# EAGLE design Qwiic_FM_Transceiver_Si4721 (EAGLE 9.5.1)
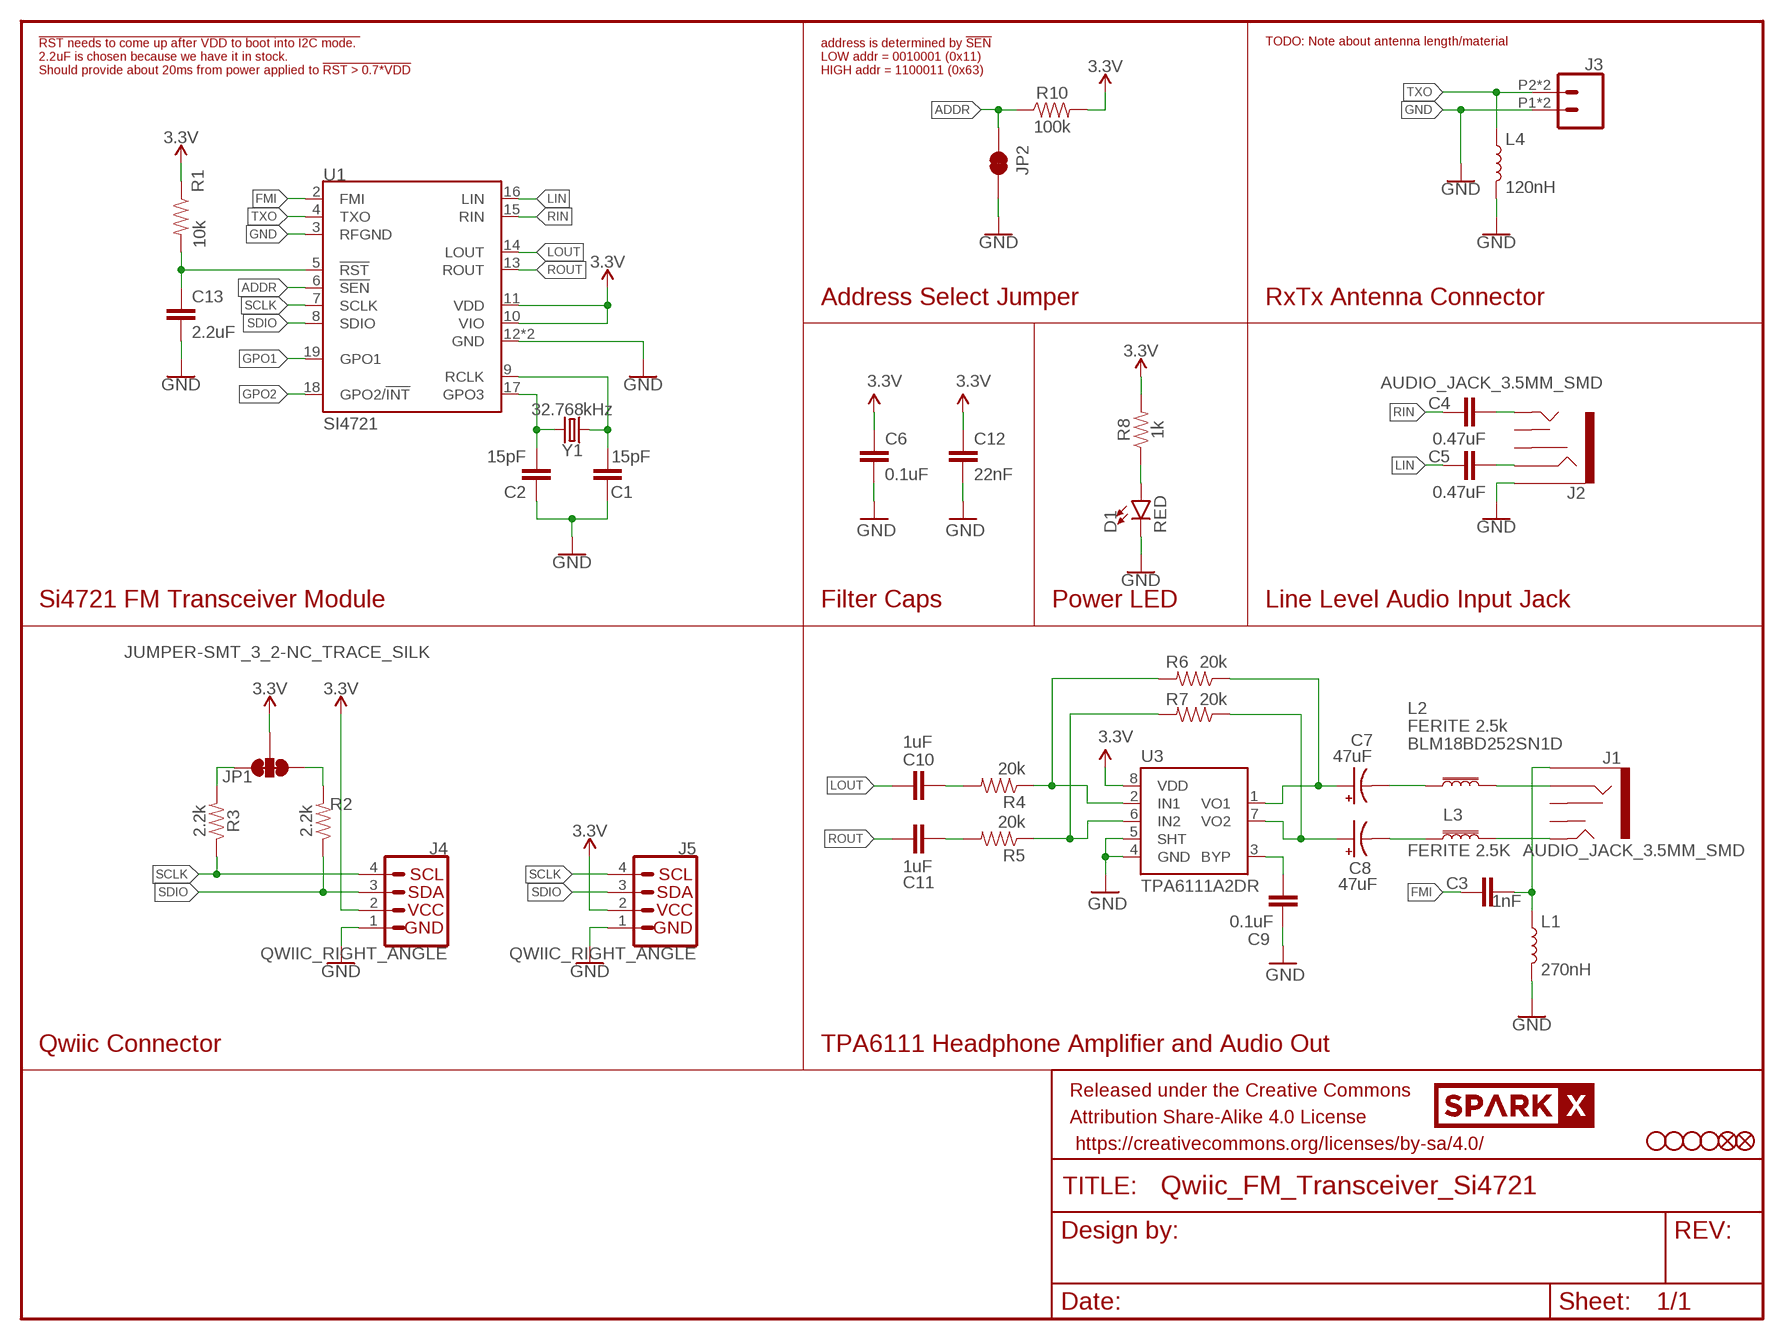
[diagram p0: schematic, sheet 1]

## Parts
C1  15pF  15PF-0603-50V-5%  [0603]
C2  15pF  15PF-0603-50V-5%  [0603]
C3  1nF  1.0NF/1000PF-0603-50V-10%  [0603]
C4  0.47uF  CAP-0603  [0603]
C5  0.47uF  CAP-0603  [0603]
C6  0.1uF  0.1UF-0603-25V-(+80/-20%)  [0603]
C7  47uF  47UF-POLAR-EIA3528-10V-10%  [EIA3528]
C8  47uF  47UF-POLAR-EIA3528-10V-10%  [EIA3528]
C9  0.1uF  0.1UF-0603-25V-(+80/-20%)  [0603]
C10  1uF  1.0UF-16V-10%(0603)  [0603-CAP]
C11  1uF  1.0UF-16V-10%(0603)  [0603-CAP]
C12  22nF  22NF/22,000PF-0603-50V-10%  [0603]
C13  2.2uF  2.2UF-0603-10V-20%  [0603]
D1  RED  LED-RED0603  [LED-0603]
FD1  FIDUCIAL0.2MM  [FIDUCIAL-0.2MM]
FD2  FIDUCIAL0.2MM  [FIDUCIAL-0.2MM]
FRAME1  FRAME-LETTER  [CREATIVE_COMMONS]
H1  STAND-OFF  [STAND-OFF]
H2  STAND-OFF  [STAND-OFF]
H3  STAND-OFF  [STAND-OFF]
H4  STAND-OFF  [STAND-OFF]
J1  AUDIO_JACK_3.5MM_SMD  [AUDIO-JACK-3.5MM-SMD]
J2  AUDIO_JACK_3.5MM_SMD  [AUDIO-JACK-3.5MM-SMD]
J3  CONN_02SMALL_POKEHOME  [1X02_POKEHOME]
J4  QWIIC_RIGHT_ANGLE  QWIIC_CONNECTORJS-1MM  [JST04_1MM_RA]
J5  QWIIC_RIGHT_ANGLE  QWIIC_CONNECTORJS-1MM  [JST04_1MM_RA]
JP1  JUMPER-SMT_3_2-NC_TRACE_SILK  [SMT-JUMPER_3_2-NC_TRACE_SILK]
JP2  JUMPER-SMT_2_NC_TRACE_SILK  [SMT-JUMPER_2_NC_TRACE_SILK]
L1  270nH  INDUCTOR-0603-15NH  [0603]
L2  FERITE 2.5k  FERRITE_BEAD-0603  [0603]
L3  FERITE 2.5K  FERRITE_BEAD-0603  [0603]
L4  120nH  INDUCTOR-0603-15NH  [0603]
R1  10k  10KOHM-0603-1/10W-1%  [0603]
R2  2.2k  2.2KOHM-0603-1/10W-1%  [0603]
R3  2.2k  2.2KOHM-0603-1/10W-1%  [0603]
R4  20k  20KOHM-0603-1/10W-5%  [0603]
R5  20k  20KOHM-0603-1/10W-5%  [0603]
R6  20k  20KOHM-0603-1/10W-5%  [0603]
R7  20k  20KOHM-0603-1/10W-5%  [0603]
R8  1k  1KOHM-0603-1/10W-1%  [0603]
R10  100k  100KOHM-0603-1/10W-1%  [0603]
U1  SI4721  [QFN-20-3X3MM]
U3  TPA6111A2DR  TPA6111SMD-T  [SO08]
U$18  SPARKX-LOGO4  [SPARKX-MEDIUM]
Y1  32.768kHz  CRYSTAL-32.768KHZSMD-3.2X1.5  [CRYSTAL-SMD-3.2X1.5MM]

## Nets
3.3V: C6.1 C12.1 J4.2 J5.2 JP1.2 R1.1 R8.2 R10.2 U1.10(VIO) U1.11(VDD) U3.8(VDD)
ADDR: JP2.1 R10.1 U1.6(!SEN)
FMI: C3.1 U1.2(FMI)
GND: C1.1 C2.1 C6.2 C9.2 C12.2 C13.2 D1.C J2.SLEEVE J3.P1 J3.P3 J4.1 J5.1 JP2.2 L1.2 L4.2 U1.3(RFGND) U1.12(GND) U1.21(GND) U3.4(GND) U3.5(SHT)
GPO1: U1.19(GPO1)
GPO2: U1.18(GPO2/!INT)
LIN: C5.1 U1.16(LIN)
LOUT: C10.1 U1.14(LOUT)
N$1: C13.1 R1.2 U1.5(!RST)
N$2: C1.2 U1.9(RCLK) Y1.P$1
N$3: J1.RING L2.2
N$4: J1.TIP L3.2
N$5: C3.2 J1.SLEEVE L1.1
N$6: C4.2 J2.TIP
N$7: C7.A(+) R6.1 U3.1(VO1)
N$8: C2.2 U1.17(GPO3) Y1.P$2
N$9: C8.A(+) R7.1 U3.7(VO2)
N$10: C9.1 U3.3(BYP)
N$11: R4.1 R6.2 U3.2(IN1)
N$12: R5.1 R7.2 U3.6(IN2)
N$13: C10.2 R4.2
N$14: C11.2 R5.2
N$15: C7.C(-) L2.1
N$16: C8.C(-) L3.1
N$17: C5.2 J2.RING
N$18: JP1.3 R2.2
N$19: JP1.1 R3.2
N$20: D1.A R8.1
RIN: C4.1 U1.15(RIN)
ROUT: C11.1 U1.13(ROUT)
SCLK: J4.4 J5.4 R3.1 U1.7(SCLK)
SDIO: J4.3 J5.3 R2.1 U1.8(SDIO)
TXO: J3.P2 J3.P4 L4.1 U1.4(TXO)
Unconnected: J1.RSH J1.TSH J2.RSH J2.TSH

## Notes on the sheet
- TODO: Note about antenna length/material
- !RST needs to come up after VDD to boot into I2C mode. 
  2.2uF is chosen because we have it in stock. 
  Should provide about 20ms from power applied to !RST > 0.7*VDD
- address is determined by !SEN
  LOW addr = 0010001 (0x11)
  HIGH addr = 1100011 (0x63)
- Address Select Jumper | RxTx Antenna Connector
- Si4721 FM Transceiver Module | Filter Caps | Power LED | Line Level Audio Input Jack
- BLM18BD252SN1D
- Qwiic Connector | TPA6111 Headphone Amplifier and Audio Out

## Library data of the parts
C1 C2 = SparkFun-Capacitors:15PF: 15pF ceramic capacitors A capacitor is a passive two-terminal electrical component used to store electrical energy temporarily in an electric field.; PROD_ID: CAP-07881
C3 = SparkFun-Capacitors:1.0NF/1000PF: 1nF/1,000pF ceramic capacitors A capacitor is a passive two-terminal electrical component used to store electrical energy temporarily in an electric field.; PROD_ID: CAP-07886
C4 C5 = SparkFun-Capacitors:CAP
C6 C9 = SparkFun-Capacitors:0.1UF: 0.1µF ceramic capacitors A capacitor is a passive two-terminal electrical component used to store electrical energy temporarily in an electric field.; PROD_ID: CAP-00810
C7 C8 = SparkFun-Capacitors:47UF-POLAR: 47µF polarized capacitors A capacitor is a passive two-terminal electrical component used to store electrical energy temporarily in an electric field.; PROD_ID: CAP-08310
C10 C11 = SparkFun-Capacitors:1.0UF-16V-10%(0603): CAP-00868; PROD_ID: CAP-00868; VALUE: 1.0uF
C12 = SparkFun-Capacitors:22NF/22,000PF: 0.022uF/22nF/22,000pF ceramic capacitors A capacitor is a passive two-terminal electrical component used to store electrical energy temporarily in an electric field.; PROD_ID: CAP-07885
C13 = SparkFun-Capacitors:2.2UF: 2.2µF ceramic capacitors A capacitor is a passive two-terminal electrical component used to store electrical energy temporarily in an electric field.; PROD_ID: CAP-07888
D1 = SparkFun-LED:LED-RED: Red SMD LED Used in manufacturing of most products at SparkFun Packages: 0603 - SMD 0603 package [Product Link] <http://docs.avagotech.com/docs/AV02-0551EN> 0603 SMART - SMD 0603 SMART package ( more efficient and expensive)[Product Link] <http://www.osram-os.com/Graphics/XPic2/00077099_0.pdf> 1206 - SMD1206 package [Product Link] <https://www.sparkfun.com/datasheets/DevTools/LilyPad/Q150OVS4.pdff> SparkFun Products: Pro Mini 328 -5V <https://www.sparkfun.com/products/821> RedBoard <https://www.sparkfun.com/products/12757> IOIO-OTG <https://www.sparkfun.com/products/13613>; PROD_ID: DIO-00819
FD1 FD2 = SparkFun-Aesthetics:FIDUCIAL: Fiducial Alignment Points Point-of-reference for pick-and-place machines and other optical instruments.
FRAME1 = SparkFun-Aesthetics:FRAME-LETTER: Schematic Frame - Letter Standard 8.5x11 US Letter frame
H1-H4 = SparkFun-Hardware:STAND-OFF: Stand Off Drill holes for mechanically mounting via screws, standoffs, etc. Note: Use the keepout ring to avoid running the screw head into surrounding components. Variant Overviews STAND-OFF - Mechanical footprint for a #4 phillips button head screw. STAND-OFF-TIGHT - Mechanical footprint for a #4 phillips button head screw, Example SparkFun Products Screw - Phillips Head (1/4", 4-40, 10 pack) <https://www.sparkfun.com/products/10453> (PRT-10453) Screw - Phillips Head (1/2", 4-40, 10 pack) <https://www.sparkfun.com/products/10452> (PRT-10452) Screw - Phillips Head (3/4", 4-40, 10 pack) <https://www.sparkfun.com/products/10451> (PRT-10451) Screw - Phillips Head (1", 4-40, 10 pack) <https://www.sparkfun.com/products/10450> (PRT-10450)
J1 J2 = SparkFun-Connectors:AUDIO_JACK_3.5MM: Audio Jack 3.5mm variants of PTH and SMT stereo audio jack with bypass switches. SparkFun Products: SparkFun SparkPunk Sound Kit <[https://www.sparkfun.com/products/11177]> - PTH MP3 Trigger <https://www.sparkfun.com/products/13720> -3.5mm SMD SparkFun PicoBoard <https://www.sparkfun.com/products/11888>- 2.5mm SMD; PROD_ID: CONN-10353
J3 = SparkFun-Connectors:CONN_02: Multi connection point. Often used as Generic Header-pin footprint for 0.1 inch spaced/style header connections On any of the 0.1 inch spaced packages, you can populate with these: Break Away Headers - Straight <https://www.sparkfun.com/products/116> (PRT-00116) Break Away Male Headers - Right Angle <https://www.sparkfun.com/products/553> (PRT-00553) Female Headers <https://www.sparkfun.com/products/115> (PRT-00115) Break Away Headers - Machine Pin <https://www.sparkfun.com/products/117> (PRT-00117) Break Away Female Headers - Swiss Machine Pin <https://www.sparkfun.com/products/743> (PRT-00743) For SCREWTERMINALS and SPRING TERMINALS visit here: Screw Terimnals on SparkFun.com <https://www.sparkfun.com/search/results?term=Screw+Terminals> (5mm/3.5mm/2.54mm spacing) This device is also useful as a general connection point to wire up your design to another part of your project. Our various solder wires solder well into these plated through hole pads. Hook-Up Wire - Assortment (Stranded, 22 AWG) <https://www.sparkfun.com/products/11375> (PRT-11375) Hook-Up Wire - Assortment (Solid Core, 22 AWG) <https://www.sparkfun.com/products/11367> (PRT-11367) View the entire wire category on our website here <https://www.sparkfun.com/categories/141> Special notes: Molex polarized connector foot print use with: PRT-08233 with associated crimp pins and housings. 2.54_SCREWTERM for use with PRT-10571. 3.5mm Screw Terminal footprints for PRT-08084 5mm Screw Terminal footprints for use with PRT-08432; PROD_ID: CONN-13512
J4 J5 = SparkFun-Connectors:QWIIC_CONNECTOR: SparkFun I2C Standard Qwiic Connector An SMD 1mm pitch JST connector makes it easy and quick (get it? Qwiic?) to connect I2C devices to each other. The Qwiic system <http://www.sparkfun.com/qwiic> enables fast and solderless connection between popular platforms and various sensors and actuators. We carry 200mm <https://www.sparkfun.com/products/14204>, 100mm <https://www.sparkfun.com/products/14205>, 50mm <https://www.sparkfun.com/products/14206>, and breadboard friendly <https://www.sparkfun.com/products/14207> Qwiic cables. We also offer 10 pcs strips <https://www.sparkfun.com/products/14323> the SMD connectors.; PROD_ID: CONN-13694
JP1 = SparkFun-Jumpers:JUMPER-SMT_3_2-NC_TRACE: Normally closed trace jumper (2 of 2 connections) This jumper has a trace between all three pads so they are normally closed (NC). Use a razor knife to open the connection(s). For best results follow the IPC guidelines for cutting traces: Cutout at least 0.063 mm (0.005 in). Remove all loose material to clean up the cut area. Seal the cut with an approved epoxy. Reapply solder to reclose the connection(s).
JP2 = SparkFun-Jumpers:JUMPER-SMT_2_NC_TRACE: Normally closed trace jumper This jumper has a trace between two pads so it's normally closed (NC). Use a razor knife to open the connection. For best results follow the IPC guidelines for cutting traces: Cutout at least 0.063 mm (0.005 in). Remove all loose material to clean up the cut area. Seal the cut with an approved epoxy. Reapply solder to reclose the connection.
L1 L4 = SparkFun-Coils:INDUCTOR: Inductors Resist changes in electrical current. Basically a coil of wire. SparkFun Products: SparkFun Load Cell Amplifier - HX711 <https://www.sparkfun.com/products/13879> IOIO-OTG - V2.2 <https://www.sparkfun.com/products/13613>; PROD_ID: NDUC-11660; VALUE: 15nH
L2 L3 = SparkFun-Coils:FERRITE_BEAD: Ferrite Bead (blocks, cores, rings, chokes, etc.) Inductor with layers of ferrite used to suppress high frequencies. Often used to isolate high frequency noise. SparkFun Products: IOIO-OTG - V2.2 <https://www.sparkfun.com/products/13613> SparkFun SAMD21 Mini Breakout <https://www.sparkfun.com/products/13664> SparkFun 6 Degrees of Freedom Breakout - LSM6DS3 <https://www.sparkfun.com/products/13339> SparkFun SAMD21 Dev Breakout <https://www.sparkfun.com/products/13672>; PROD_ID: NDUC-13805; VALUE: 30Ω/1.8A
R1 = SparkFun-Resistors:10KOHM: 10kΩ resistor A resistor is a passive two-terminal electrical component that implements electrical resistance as a circuit element. Resistors act to reduce current flow, and, at the same time, act to lower voltage levels within circuits. - Wikipedia; PROD_ID: RES-00824
R2 R3 = SparkFun-Resistors:2.2KOHM: 2.2kΩ resistor A resistor is a passive two-terminal electrical component that implements electrical resistance as a circuit element. Resistors act to reduce current flow, and, at the same time, act to lower voltage levels within circuits. - Wikipedia; PROD_ID: RES-08272
R4-R7 = SparkFun-Resistors:20KOHM: 20kΩ resistor A resistor is a passive two-terminal electrical component that implements electrical resistance as a circuit element. Resistors act to reduce current flow, and, at the same time, act to lower voltage levels within circuits. - Wikipedia; PROD_ID: RES-09231
R8 = SparkFun-Resistors:1KOHM: 1kΩ resistor A resistor is a passive two-terminal electrical component that implements electrical resistance as a circuit element. Resistors act to reduce current flow, and, at the same time, act to lower voltage levels within circuits. - Wikipedia; PROD_ID: RES-07856
R10 = SparkFun-Resistors:100KOHM: 100kΩ resistor A resistor is a passive two-terminal electrical component that implements electrical resistance as a circuit element. Resistors act to reduce current flow, and, at the same time, act to lower voltage levels within circuits. - Wikipedia; PROD_ID: RES-07828
U1 = SparkFun-RF:SI4721
U3 = SparkFun-IC-Amplifiers:TPA6111: TPA6111A2 Basic 150mW stereo headphone amplifier. SparkFun Products SparkFun FM Tuner Evaluation Board - Si4703 <https://www.sparkfun.com/products/12938> (WRL-12938); PROD_ID: IC-10149
U$18 = SparkX:SPARKX-LOGO
Y1 = SparkFun-Clocks:CRYSTAL-32.768KHZ: 32.768kHz Crystal Frequency: 32.768kHz Frequency Stability: ±20ppm Load Capacitance: 12.5pF (PTH-2X6 & SMD-3.2X1.5), 6pF (SMD-2X6) SparkFun Products: SparkFun BigTime Watch Kit <https://www.sparkfun.com/products/11734> SparkFun nRF52832 Breakout <https://www.sparkfun.com/products/13990> SparkFun Real Time Clock Module <https://www.sparkfun.com/products/12708>; PROD_ID: XTAL-13062

## Board
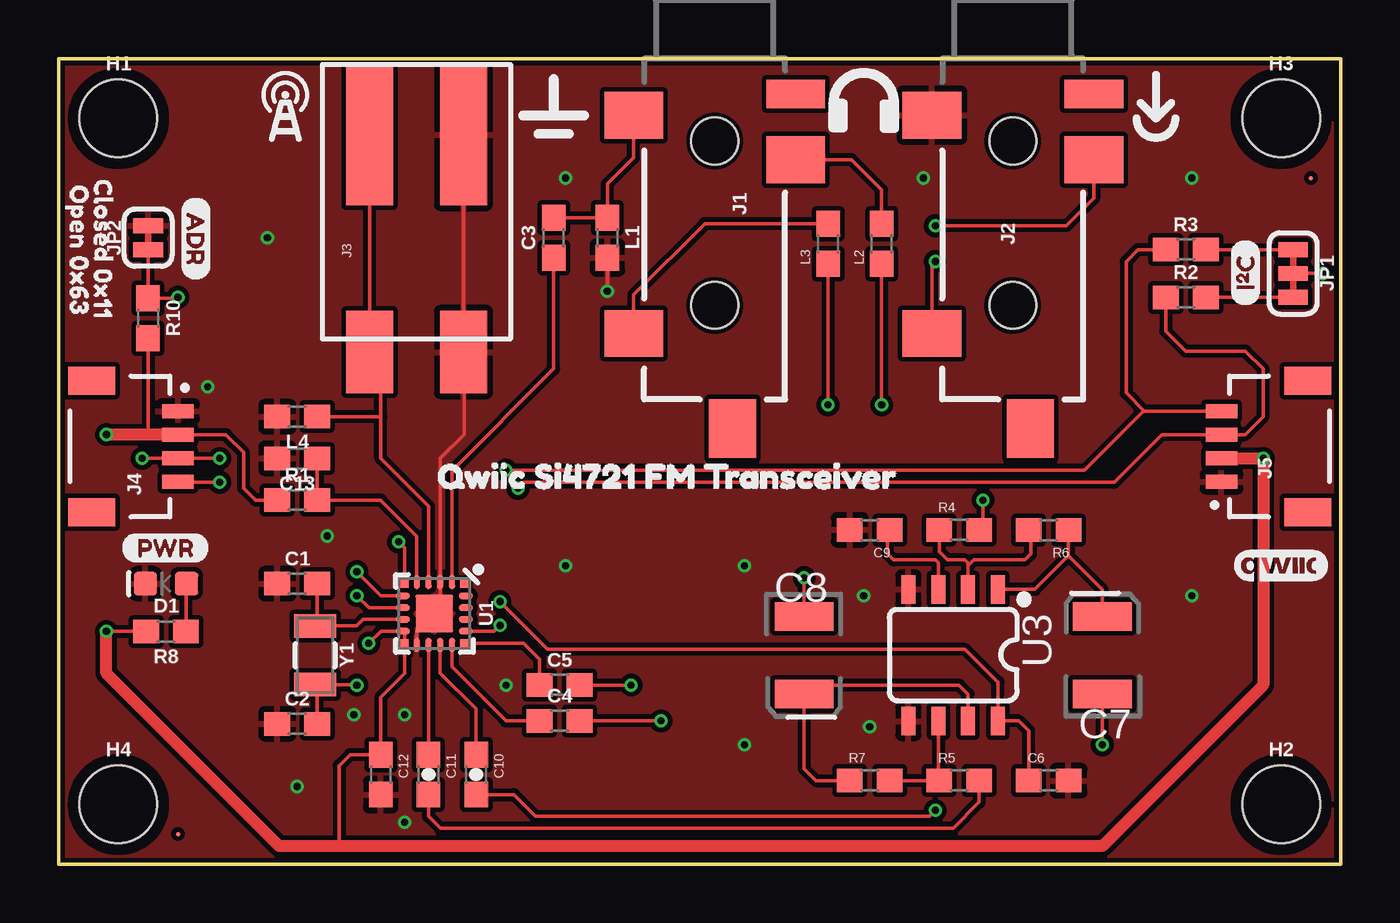
[diagram p1: board, top side]
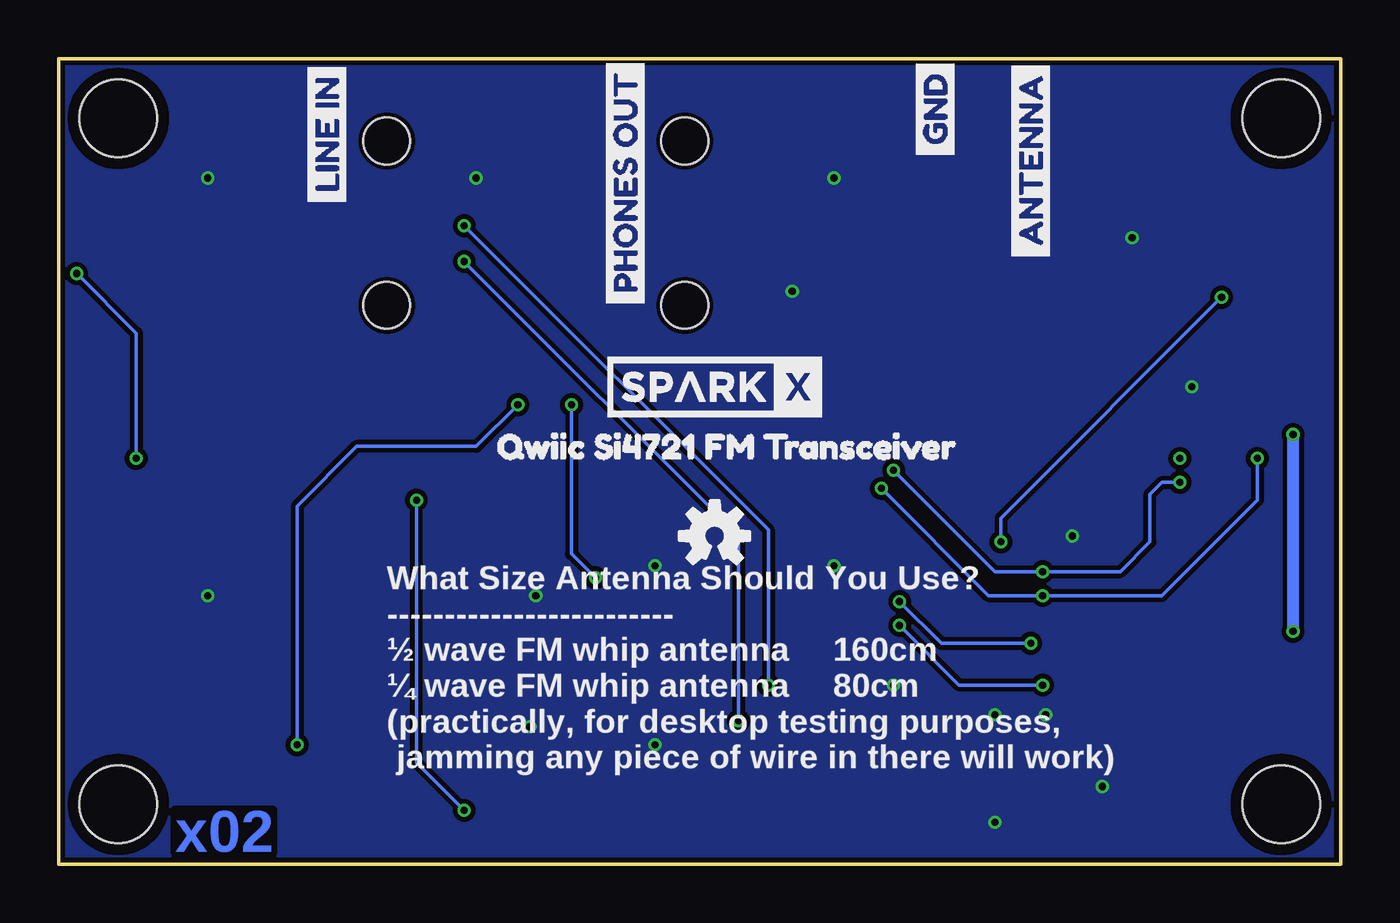
[diagram p2: board, bottom side, seen from below]

Size 54.61 x 34.29 mm. Coordinates in mm from the lower left corner, seen from the top.
Outline: 0,0 0,34.29 54.61,34.29 54.61,0 0,0
Copper layers (1*16): Top 0.035mm / dielectric 1.5mm / Bottom 0.035mm
Design rules "SparkFun-2-layer-FAB-LIMIT": minimum track width 4mil, minimum drill 6mil, track to track 4mil, track to pad 4mil, pad to pad 4mil, via to via 4mil, smd to smd 4mil, copper to edge 4mil, drill to drill 4mil, minimum pad ring 5mil, minimum via ring 5mil, stop-mask expansion 4mil, vias tented up to drill 25mil, thermal gap 10mil

### Footprints (pad centres in the part's own frame; a part is rotated, then mirrored left to right if it is on the bottom)
0603 = smd 1.1 x 1: 1 -0.85,0; 2 0.85,0
EIA3528 = smd 1.2 x 2.5: A 1.65,0; C -1.65,0
0603-CAP = smd 1.1 x 1: 1 -0.85,0; 2 0.85,0
LED-0603 = smd 1 x 1: A -0.877,0; C 0.877,0
FIDUCIAL-0.2MM = smd 0.2 x 0.2: 1 0,0
STAND-OFF = hole 3.302: 0,0
AUDIO-JACK-3.5MM-SMD = smd 2 x 2.5: RING 4.3,3.45; SLEEVE 2.4,-3.45; TIP 11.7,-3.45 | smd 1.2 x 2.5: RSH 1.5,3.45 | smd 2.5 x 2: TSH 15.75,0.75 | hole 2: 3.5,0; 10.5,0
1X02_POKEHOME = smd 3.5 x 2: P1 5.25,2; P2 5.25,-2 | smd 6 x 2: P3 -4,2; P4 -4,-2
JST04_1MM_RA = smd 0.6 x 1.35: 1 -1.5,0; 2 -0.5,0; 3 0.5,0; 4 1.5,0 | smd 1.2 x 2: NC1 2.8,-3.675; NC2 -2.8,-3.675
SMT-JUMPER_3_2-NC_TRACE_SILK = smd 0.635 x 1.27: 1 -1.016,0; 2 0,0; 3 1.016,0
SMT-JUMPER_2_NC_TRACE_SILK = smd 0.635 x 1.27: 1 -0.508,0; 2 0.508,0
QFN-20-3X3MM = smd 0.34 x 0.34: 1 -1.275,1.265; 6 -1.265,-1.265; 11 1.265,-1.265; 16 1.265,1.265 | smd 0.61 x 0.28: 2 -1.335,0.75; 3 -1.335,0.25; 4 -1.335,-0.25; 5 -1.335,-0.75; 12 1.335,-0.75; 13 1.335,-0.25; 14 1.335,0.25; 15 1.335,0.75 | smd 0.28 x 0.61: 7 -0.75,-1.335; 8 -0.25,-1.335; 9 0.25,-1.335; 10 0.75,-1.335; 17 0.75,1.335; 18 0.25,1.335; 19 -0.25,1.335; 20 -0.75,1.335 | smd 1.6 x 1.6: 21 0,0
SO08 = smd 0.6 x 1.2: 1 -1.905,-2.8; 2 -0.635,-2.8; 3 0.635,-2.8; 4 1.905,-2.8; 5 1.905,2.8; 6 0.635,2.8; 7 -0.635,2.8; 8 -1.905,2.8
CRYSTAL-SMD-3.2X1.5MM = smd 1 x 1.8: P$1 -1.25,0; P$2 1.25,0

### Placement (x,y rotation side)
C1  10.16,11.94 0 top
C2  10.16,5.97 0 top
C3  21.08,26.67 90 top
C4  21.34,6.1 0 top
C5  21.34,7.62 0 top
C6  42.16,3.56 0 top
C7  44.45,8.89 90 top
C8  31.75,8.89 270 top
C9  34.54,14.22 180 top
C10  17.78,3.81 270 top
C11  15.75,3.81 270 top
C12  13.72,3.81 270 top
C13  10.16,17.27 180 top
D1  4.57,11.94 180 top
FD1  53.34,29.21 0 top
FD2  5.08,1.27 0 top
FRAME1  5.08,-13.97 0 top  (outside the outline)
H1  2.54,31.75 0 top
H2  52.07,2.54 0 top
H3  52.07,31.75 0 top
H4  2.54,2.54 0 top
J1  27.94,34.29 270 top
J2  40.64,34.29 270 top
J3  15.24,27.05 270 top
J4  5.08,17.78 270 top
J5  49.53,17.78 90 top
JP1  52.58,25.15 270 top
JP2  3.81,26.67 90 top
L1  23.37,26.67 270 top
L2  35.05,26.42 90 top
L3  32.77,26.42 90 top
L4  10.16,19.05 180 top
R1  10.16,15.49 0 top
R2  48.01,24.13 0 top
R3  48.01,26.16 0 top
R4  38.35,14.22 0 top
R5  38.35,3.56 0 top
R6  42.16,14.22 180 top
R7  34.54,3.56 0 top
R8  4.57,9.91 180 top
R10  3.81,23.24 270 top
U1  16,10.67 270 top
U3  38.1,8.89 180 top
U$1  [QWIIC_SI4721_FM_TRANSCEIVER0]  15.24,16.51 0 top
U$2  [QWIIC_SI4721_FM_TRANSCEIVER0]  36.83,17.78 0 bottom
U$3  [QWIIC_4MM]  52.07,12.7 0 top
U$4  [ANTENNA1]  13.21,25.4 90 bottom
U$5  [PWR-()-03]  2.67,13.46 0 top
U$6  [OSHW-LOGO-S]  26.67,13.97 0 bottom
U$7  [GND0]  17.27,29.72 90 bottom
U$8  [LINE_IN2]  43.18,27.69 90 bottom
U$9  [PHONES_OUT3]  30.48,23.37 90 bottom
U$10  [PHONES#PNG]  34.29,32.51 0 top
U$11  [IN#PNG]  46.74,32.26 0 top
U$12  [GND#PNG]  21.08,32.26 0 top
U$13  [ANTENNA#PNG]  9.65,32.26 0 top
U$14  [I_SUPER2_C-()-03]  50.55,23.75 90 top
U$15  [CLOSED_0X110]  1.91,29.84 270 top
U$16  [ADR-()-03]  5.84,28.45 270 top
U$17  [OPEN_0X631]  0.89,29.59 270 top
U$18  26.67,20.32 0 bottom
Y1  10.92,8.89 270 top

### Tracks (layer width: path | path; a pad name or v marks a point on that pad's centre or on a via)
3.3V  (via drill 0.3)
  Top 0.152: C6.1 41.31,5.68 40.89,6.1 U3.8 40.01,7.75 38.61,9.14 20.83,9.14 v18.8,11.18 | R1.1 8.38,15.49 7.87,16 7.87,17.53 7.12,18.28 J4.2 | v13.21,9.4 13.73,9.92 U1.10 14.74,9.85 U1.11 14.74,8.13 13.72,7.11 C12.1 12.41,4.66 11.94,4.19 11.94,0.89 12.06,0.76 | JP1.2 v53.85,25.15 | v2.03,9.91 R8.2 | R10.2 3.81,18.28
  Top 0.508: J5.2 v51.3,17.28 v51.31,17.27 51.31,7.62 44.45,0.76 12.06,0.76 9.4,0.76 2.03,8.13 v2.03,9.91 | J4.2 3.81,18.28 v2.04,18.28 v2.03,18.29
  Bottom 0.152: v18.8,11.18 17.02,9.4 v13.21,9.4 | v53.85,25.15 51.31,22.61 v51.31,17.27
  Bottom 0.508: v2.03,9.91 v2.03,18.29
ADDR  (via drill 0.3)
  Top 0.152: U1.6 14.74,13.46 v14.48,13.72 | JP2.1 R10.1 5.04,24.09 v5.08,24.13
  Bottom 0.152: v5.08,24.13 14.48,14.73 v14.48,13.72
FMI
  Top 0.152: U1.2 16.75,16.75 21.08,21.08 C3.1
GND  (via drill 0.3)
  Top 0.152: L1.2 v23.37,24.38 | U1.12 15.25,9.92 U1.21 16.25,10.92 U1.3 16.25,17.27 17.27,18.29 17.27,22.83 17.24,22.86 | J3.P1 17.24,22.86 | 17.24,22.86 J3.P3
  other vias: 34.54,5.84 34.29,11.43 12.57,6.35 14.73,6.35 14.73,1.78 10.16,3.3 8.89,26.67 6.35,20.32 11.43,13.97 21.59,12.7 29.21,12.7 29.21,5.08 48.26,11.43 48.26,29.21 21.59,29.21 36.83,29.21 19.05,7.62
  pour Bottom (isolate 0.203): 0,34.29 54.61,34.29 54.61,0 0,0
  pour Top (isolate 0.203): 0,34.29 54.61,34.29 54.61,0 0,0
LIN
  Top 0.152: U1.16 19.81,9.4 20.49,8.72 C5.1
LOUT
  Top 0.152: U1.14 16.25,8.13 17.78,6.6 C10.1
N$1
  Top 0.152: U1.5 15.25,13.96 13.72,15.49 R1.2 C13.1
N$2
  Top 0.152: C1.2 11.01,10.23 10.93,10.15 | 10.93,10.15 Y1.P$1 | U1.9 12.96,10.42 12.69,10.15 10.93,10.15
N$3
  Top 0.152: L2.2 35.05,28.7 33.76,29.99 J1.RING
N$4
  Top 0.152: L3.2 27.52,27.27 24.49,24.24 J1.TIP
N$5
  Top 0.152: C3.2 L1.1 23.37,28.96 24.49,30.08 J1.SLEEVE
N$6  (via drill 0.3)
  Top 0.152: J2.TIP 37.19,25.51 v37.34,25.65 | v25.65,6.1 C4.2
  Bottom 0.152: v37.34,25.65 25.65,13.97 v25.65,6.1
N$7
  Top 0.152: R6.1 43.01,13.12 | C7.A 44.45,11.68 43.01,13.12 | 43.01,13.12 41.58,11.69 U3.1
N$8  (via drill 0.3)
  Top 0.152: C2.2 11.01,7.55 Y1.P$2 12.68,7.64 v12.7,7.62 | v18.8,10.16 18.55,9.92 U1.17
  Bottom 0.152: v12.7,7.62 16.26,7.62 v18.8,10.16
N$9
  Top 0.152: R7.1 32.26,3.56 31.75,4.06 C8.A 32.13,7.62 38.35,7.62 38.73,7.24 U3.7
N$10
  Top 0.152: U3.3 37.47,12.83 37.34,12.95 35.56,12.95 35.31,13.21 35.31,14.14 C9.1
N$11
  Top 0.152: R4.1 37.5,13.3 37.85,12.95 38.61,12.95 38.73,12.83 38.73,12.7 | U3.2 38.73,12.7 | 38.73,12.7 38.99,12.95 41.15,12.95 41.4,13.21 41.4,14.14 R6.2
N$12
  Top 0.152: U3.6 37.47,3.6 R5.1 R7.2
N$13  (via drill 0.3)
  Top 0.152: C10.2 19.39,2.96 20.32,2.03 37.08,2.03 v37.34,2.29 | v39.37,15.49 39.37,14.39 R4.2
  Bottom 0.152: v37.34,2.29 39.37,4.32 v39.37,15.49
N$14
  Top 0.152: R5.2 39.2,2.63 38.1,1.52 16.26,1.52 15.75,2.03 C11.2
N$15  (via drill 0.3)
  Top 0.152: L2.1 v35.05,19.56 | v44.45,5.08 C7.C
  Bottom 0.152: v35.05,19.56 36.83,17.78 41.91,17.78 44.45,15.24 v44.45,5.08
N$16  (via drill 0.3)
  Top 0.152: L3.1 v32.77,19.56 | v31.75,12.19 C8.C
  Bottom 0.152: v32.77,19.56 32.77,13.21 v31.75,12.19
N$17  (via drill 0.3)
  Top 0.152: J2.RING 44.09,28.34 42.93,27.18 v37.34,27.18 | v24.38,7.62 C5.2
  Bottom 0.152: v37.34,27.18 24.38,14.22 v24.38,7.62
N$18
  Top 0.152: R2.2 JP1.3
N$19
  Top 0.152: R3.2 JP1.1
N$20
  Top 0.152: R8.1 5.42,11.91 D1.A
RIN
  Top 0.152: U1.15 16.75,8.39 19.05,6.1 C4.1
ROUT
  Top 0.152: U1.13 C11.1
SCLK  (via drill 0.3)
  Top 0.152: R3.1 45.97,26.16 45.47,25.65 45.47,20.07 46.25,19.28 | J5.4 46.25,19.28 | 46.25,19.28 46.2,19.28 43.69,16.76 v19.05,16.76 | U1.7 14.65,11.43 13.72,11.43 v12.7,12.45 | J4.4 5.1,16.26 v6.86,16.26
  Bottom 0.152: v19.05,16.76 14.73,12.45 v12.7,12.45 9.4,12.45 8.13,13.72 8.13,15.75 7.62,16.26 v6.86,16.26
SDIO  (via drill 0.3)
  Top 0.152: R2.1 47.16,22.69 48.01,21.84 50.55,21.84 51.31,21.08 51.31,19.05 50.54,18.28 J5.3 46.98,18.28 44.96,16.26 19.83,16.26 v19.57,15.99 | U1.8 13.21,10.92 v12.7,11.43 | v6.86,17.27 v6.85,17.28 J4.3 v3.56,17.28 v3.56,17.27
  Bottom 0.152: v19.57,15.99 15,11.43 v12.7,11.43 7.62,11.43 3.56,15.49 v3.56,17.27
TXO
  Top 0.152: U1.4 15.75,15.24 13.72,17.27 13.72,19.05 | 13.72,19.05 L4.1 | 13.72,19.05 13.72,21.8 J3.P2 J3.P4

### Text on the board
Bottom: x02
bPlace: What Size Antenna Should You Use? / ------------------------- / ½ wave FM whip antenna ≌ 160cm / ¼ wave FM whip antenna ≌ 80cm / (practically, for desktop testing purposes, / jamming any piece of wire in there will work)